# EAGLE design Adafruit Servo HAT rev A (EAGLE 6.3)

## Sheet 1 of 2
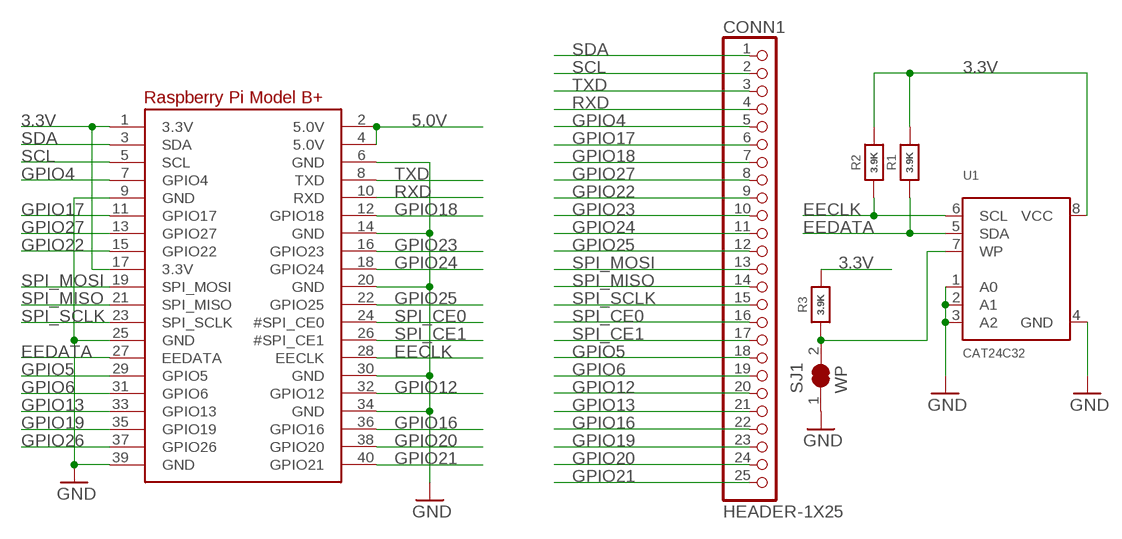
[diagram p0: schematic, sheet 1]

### Parts
CONN1  HEADER-1X25  [1X25_ROUND_70MIL]
R1  3.9K  RESISTOR0805_NOOUTLINE  [0805-NO]
R2  3.9K  RESISTOR0805_NOOUTLINE  [0805-NO]
R3  3.9K  RESISTOR0805_NOOUTLINE  [0805-NO]
RPI1  RASPBERRYPI_BPLUS_HATSLOTS  [PI_HAT_SLOTS]
SJ1  WP  SOLDERJUMPER_CLOSED  [SOLDERJUMPER_CLOSEDWIRE]
U1  CAT24C32  EEPROM_I2C_SOIC8_GENERIC  [SOIC8_150MIL]

### Nets
3.3V: R1.2 R2.2 R3.2 RPI1.1(3.3V) RPI1.17(3.3V) U1.8(VCC) ; also sheet 2
5.0V: RPI1.2(5.0V) RPI1.4(5.0V)
EECLK: R2.1 RPI1.28(EECLK) U1.6(SCL)
EEDATA: R1.1 RPI1.27(EEDATA) U1.5(SDA)
GND: RPI1.6(GND) RPI1.9(GND) RPI1.14(GND) RPI1.20(GND) RPI1.25(GND) RPI1.30(GND) RPI1.34(GND) RPI1.39(GND) SJ1.1 U1.1(A0) U1.2(A1) U1.3(A2) U1.4(GND) ; also sheet 2
GPIO4: CONN1.5 RPI1.7(GPIO4)
GPIO5: CONN1.18 RPI1.29(GPIO5)
GPIO6: CONN1.19 RPI1.31(GPIO6)
GPIO12: CONN1.20 RPI1.32(GPIO12)
GPIO13: CONN1.21 RPI1.33(GPIO13)
GPIO16: CONN1.22 RPI1.36(GPIO16)
GPIO17: CONN1.6 RPI1.11(GPIO17)
GPIO18: CONN1.7 RPI1.12(GPIO18)
GPIO19: CONN1.23 RPI1.35(GPIO19)
GPIO20: CONN1.24 RPI1.38(GPIO20)
GPIO21: CONN1.25 RPI1.40(GPIO21)
GPIO22: CONN1.9 RPI1.15(GPIO22)
GPIO23: CONN1.10 RPI1.16(GPIO23)
GPIO24: CONN1.11 RPI1.18(GPIO24)
GPIO25: CONN1.12 RPI1.22(GPIO25)
GPIO26: RPI1.37(GPIO26)
GPIO27: CONN1.8 RPI1.13(GPIO27)
N$16: R3.1 SJ1.2 U1.7(WP)
RXD: CONN1.4 RPI1.10(RXD)
SCL: CONN1.2 RPI1.5(SCL) ; also sheet 2
SDA: CONN1.1 RPI1.3(SDA) ; also sheet 2
SPI_CE0: CONN1.16 RPI1.24(#SPI_CE0)
SPI_CE1: CONN1.17 RPI1.26(#SPI_CE1)
SPI_MISO: CONN1.14 RPI1.21(SPI_MISO)
SPI_MOSI: CONN1.13 RPI1.19(SPI_MOSI)
SPI_SCLK: CONN1.15 RPI1.23(SPI_SCLK)
TXD: CONN1.3 RPI1.8(TXD)

## Sheet 2 of 2
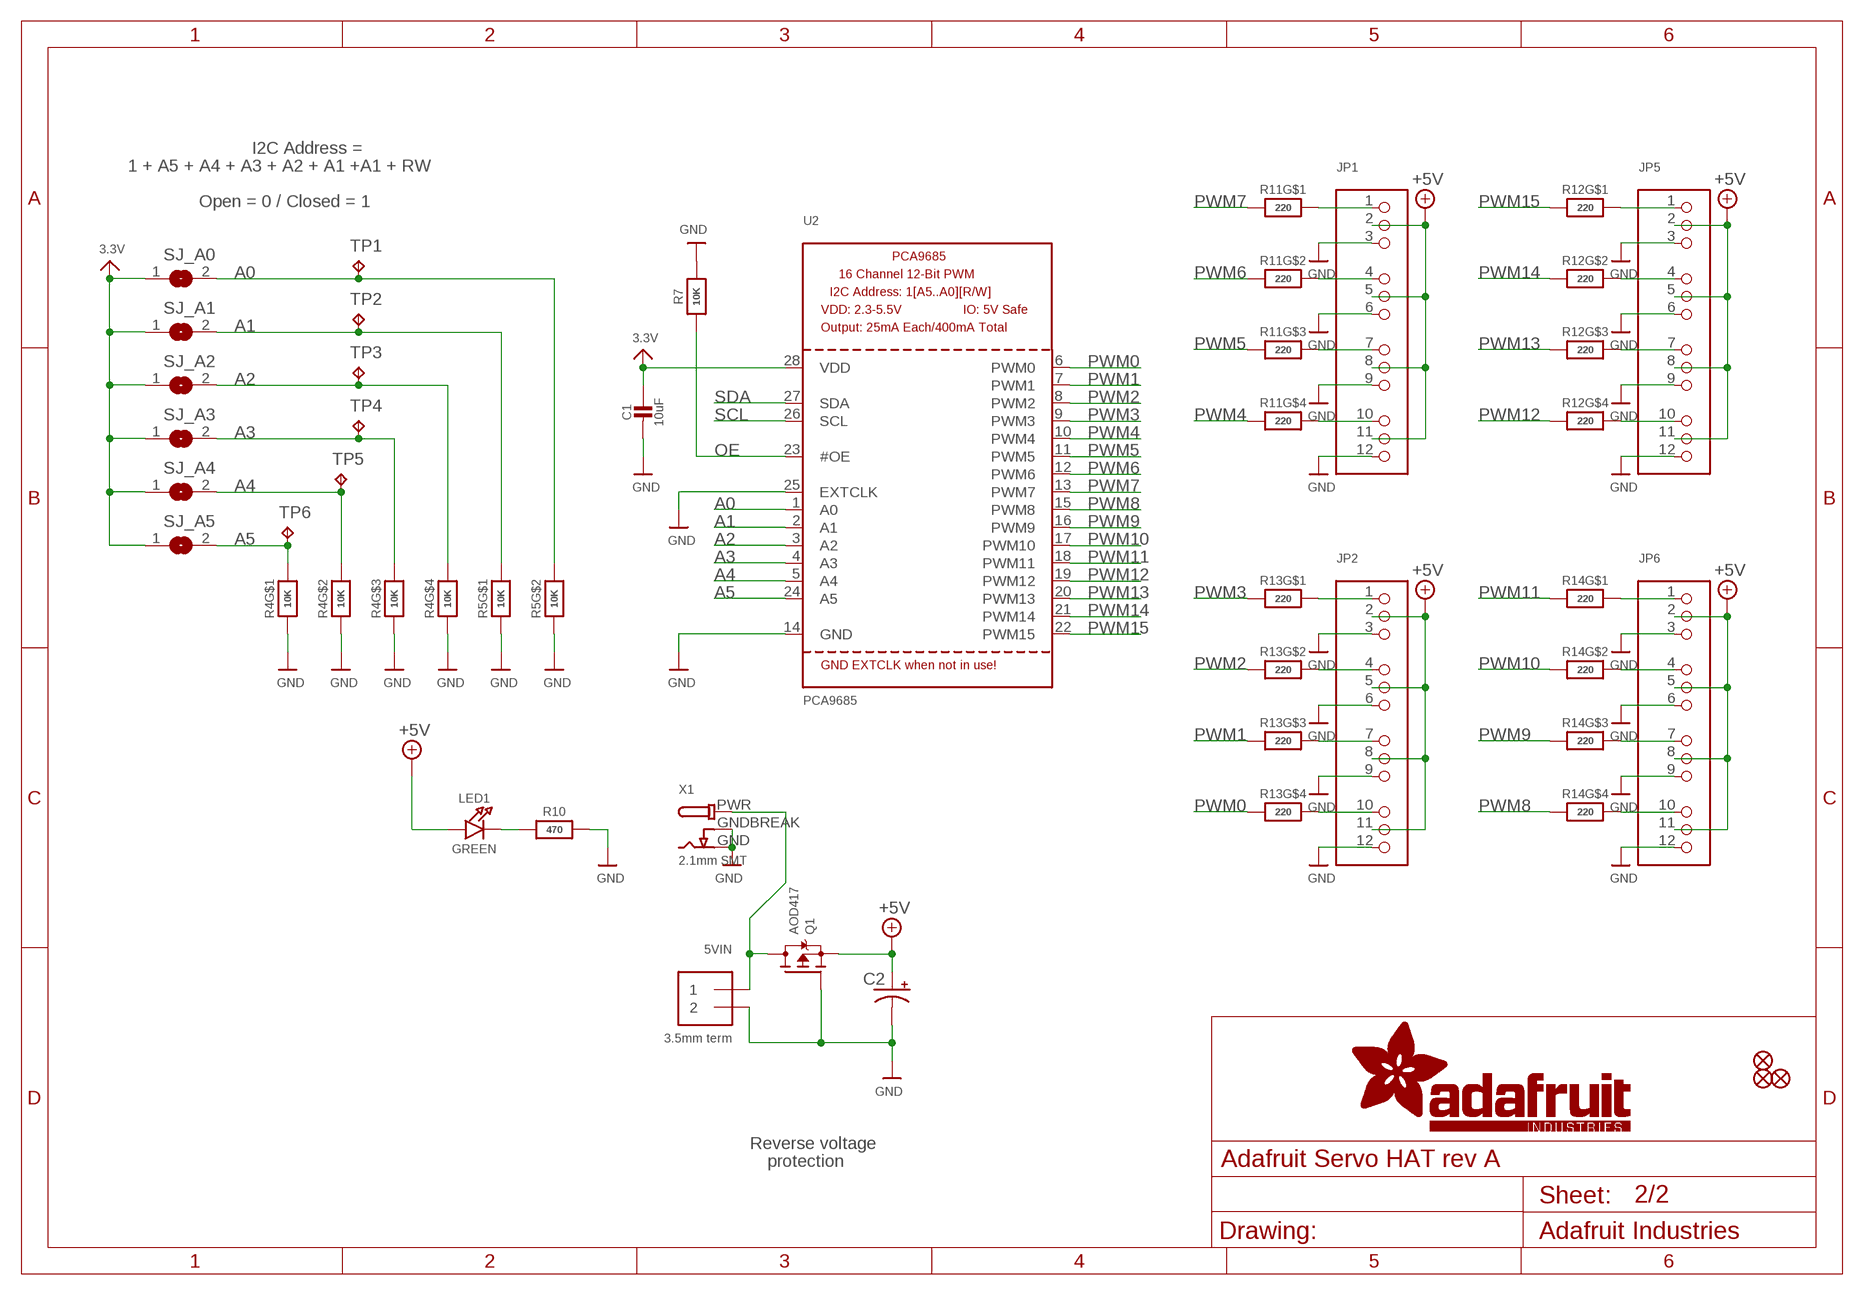
[diagram p1: schematic, sheet 2]

### Parts
5VIN  3.5mm term  TERMBLOCK_1X2  [TERMBLOCK_1X2-3.5MM]
C1  10uF  CAP_CERAMIC0805-NOOUTLINE  [0805-NO]
C2  CPOL-USE3.5-8  [E3,5-8]
FID1  FIDUCIAL""  [FIDUCIAL_1MM]
FID2  FIDUCIAL""  [FIDUCIAL_1MM]
FID3  FIDUCIAL""  [FIDUCIAL_1MM]
JP1  HEADER-3X04  [3X04]
JP2  HEADER-3X04  [3X04]
JP5  HEADER-3X04  [3X04]
JP6  HEADER-3X04  [3X04]
LED1  GREEN  LED0805_NOOUTLINE  [CHIPLED_0805_NOOUTLINE]
Q1  AOD417  MOSFET-PTO252  [TO252]
R4  10K  RESISTOR_4PACK  [RESPACK_4X0603]
R5  10K  RESISTOR_4PACK  [RESPACK_4X0603]
R7  10K  RESISTOR0805_NOOUTLINE  [0805-NO]
R10  470  RESISTOR_0805MP  [_0805MP]
R11  220  RESISTOR_4PACK  [RESPACK_4X0603]
R12  220  RESISTOR_4PACK  [RESPACK_4X0603]
R13  220  RESISTOR_4PACK  [RESPACK_4X0603]
R14  220  RESISTOR_4PACK  [RESPACK_4X0603]
SJ_A0  SOLDERJUMPERREFLOW_NOPASTE  [SOLDERJUMPER_REFLOW_NOPASTE]
SJ_A1  SOLDERJUMPERREFLOW_NOPASTE  [SOLDERJUMPER_REFLOW_NOPASTE]
SJ_A2  SOLDERJUMPERREFLOW_NOPASTE  [SOLDERJUMPER_REFLOW_NOPASTE]
SJ_A3  SOLDERJUMPERREFLOW_NOPASTE  [SOLDERJUMPER_REFLOW_NOPASTE]
SJ_A4  SOLDERJUMPERREFLOW_NOPASTE  [SOLDERJUMPER_REFLOW_NOPASTE]
SJ_A5  SOLDERJUMPERREFLOW_NOPASTE  [SOLDERJUMPER_REFLOW_NOPASTE]
TP1  TPB1,27  [B1,27]
TP2  TPB1,27  [B1,27]
TP3  TPB1,27  [B1,27]
TP4  TPB1,27  [B1,27]
TP5  TPB1,27  [B1,27]
TP6  TPB1,27  [B1,27]
U2  PCA9685  [TSSOP28]
X1  2.1mm SMT  DCBARRELSMT_CORRECT  [DCJACK_2MM_SMT]

### Nets
3.3V: C1.1 SJ_A0.1 SJ_A1.1 SJ_A2.1 SJ_A3.1 SJ_A4.1 SJ_A5.1 U2.28(VDD) ; also sheet 1
+5V: C2.+ JP1.2 JP1.5 JP1.8 JP1.11 JP2.2 JP2.5 JP2.8 JP2.11 JP5.2 JP5.5 JP5.8 JP5.11 JP6.2 JP6.5 JP6.8 JP6.11 LED1.A Q1.2(S)
A0: R5.7 SJ_A0.2 TP1.TP U2.1(A0)
A1: R5.8 SJ_A1.2 TP2.TP U2.2(A1)
A2: R4.5 SJ_A2.2 TP3.TP U2.3(A2)
A3: R4.6 SJ_A3.2 TP4.TP U2.4(A3)
A4: R4.7 SJ_A4.2 TP5.TP U2.5(A4)
A5: R4.8 SJ_A5.2 TP6.TP U2.24(A5)
GND: 5VIN.2 C1.2 C2.- JP1.3 JP1.6 JP1.9 JP1.12 JP2.3 JP2.6 JP2.9 JP2.12 JP5.3 JP5.6 JP5.9 JP5.12 JP6.3 JP6.6 JP6.9 JP6.12 Q1.1(G) R4.1 R4.2 R4.3 R4.4 R5.1 R5.2 R7.2 R10.2 U2.14(GND) U2.25(EXTCLK) X1.GND X1.GNDBREAK ; also sheet 1
N$24: LED1.C R10.1
N$25: JP1.4 R11.7
N$26: JP1.1 R11.8
N$27: JP1.7 R11.6
N$28: JP1.10 R11.5
N$29: JP2.1 R13.8
N$30: JP2.4 R13.7
N$31: JP2.7 R13.6
N$32: JP2.10 R13.5
N$33: JP6.10 R14.5
N$34: JP6.7 R14.6
N$35: JP6.4 R14.7
N$36: JP6.1 R14.8
N$37: JP5.10 R12.5
N$38: JP5.7 R12.6
N$40: JP5.4 R12.7
N$63: JP5.1 R12.8
OE: R7.1 U2.23(#OE)
PWM0: R13.4 U2.6(PWM0)
PWM1: R13.3 U2.7(PWM1)
PWM2: R13.2 U2.8(PWM2)
PWM3: R13.1 U2.9(PWM3)
PWM4: R11.4 U2.10(PWM4)
PWM5: R11.3 U2.11(PWM5)
PWM6: R11.2 U2.12(PWM6)
PWM7: R11.1 U2.13(PWM7)
PWM8: R14.4 U2.15(PWM8)
PWM9: R14.3 U2.16(PWM9)
PWM10: R14.2 U2.17(PWM10)
PWM11: R14.1 U2.18(PWM11)
PWM12: R12.4 U2.19(PWM12)
PWM13: R12.3 U2.20(PWM13)
PWM14: R12.2 U2.21(PWM14)
PWM15: R12.1 U2.22(PWM15)
PWRIN: 5VIN.1 Q1.3(D) X1.PWR
SCL: U2.26(SCL) ; also sheet 1
SDA: U2.27(SDA) ; also sheet 1
Unconnected: R5.3 R5.4 R5.5 R5.6

### Notes on the sheet
- I2C Address =
- 1 + A5 + A4 + A3 + A2 + A1 +A1 + RW
- Open = 0 / Closed = 1
- Reverse voltage
- protection

## Library data of the parts
5VIN = microbuilder:TERMBLOCK_1X2: 3.5mm Terminal block http://www.ladyada.net/library/pcb/eaglelibrary.html
C1 = microbuilder:CAP_CERAMIC: Ceramic Capacitors For new designs, use the packages preceded by an '_' character since they are more reliable: The following footprints should be used on most boards: _0402 - Standard footprint for regular board layouts _0603 - Standard footprint for regular board layouts _0805 - Standard footprint for regular board layouts _1206 - Standard footprint for regular board layouts For extremely tight-pitch boards where space is at a premium, the following 'micro-pitch' footprints can be used (smaller pads, no silkscreen outline, etc.): _0402MP - Micro-pitch footprint for very dense/compact boards _0603MP - Micro-pitch footprint for very dense/compact boards _0805MP - Micro-pitch footprint for very dense/compact boards _1206MP - Micro-pitch footprint for very dense/compact boards
C2 = adafruit:CPOL-US: POLARIZED CAPACITOR, American symbol
CONN1 = microbuilder:HEADER-1X25
FID1-FID3 = microbuilder:FIDUCIAL: Fiducial Alignment Points Various fiducial points for machine vision alignment.; BOM: EXCLUDE
JP1 JP2 JP5 JP6 = microbuilder:HEADER-3X04
LED1 = microbuilder:LED: LED 0603 - 0603 Surface Mount Package 2mA: Green LED - Low Power (3.9mcd, 2ma, 1.7Vf) - Digikey: 475-2709-2-ND Orange LED - Low Power (9.8mcd, 2ma, 1.8Vf) - Digikey: 475-1194-2-ND Red LED - Low Power (5mcd, 2ma, 1.8Vf) - Digikey: 475-1195-2-ND Yellow LED - Low Power (7mcd, 2ma, 1.8Vf) - Digikey: 475-1196-2-ND 5mA: Blue LED - Low Power (17mcd, 5ma, 2.9Vf) - Digikey: LNJ937W8CRACT-ND 0805 - 0805 Surface Mount Package 2mA: Red LED (8.8mcd, 2mA, 1.8Vf, Clear) - Low Power [Digikey: 475-2510-1-ND] Green LED (5mcd, 2mA, 1.8Vf, Clear) - Low Power [Digikey: 475-2730-1-ND] Yellow LED (11.3mcd, 2mA, 1.8Vf, Clear) - Low Power [Digikey: 475-2555-1-ND] 20mA: Red LED (104mcd, 20mA, Diffused) - LS R976 [Digikey: 475-1278-6-ND] Red LED (12mcd, 20mA, 2.0Vf, Clear) - APT2012EC [Digikey: 754-1128-1-ND] Green LED (15mcd, 20mA, 2.2Vf, Clear) - APT2012GC [Digikey: 754-1131-1-ND] Orange LED (160mcd, 20mA, 2.1Vf, Clear) - APT2012SECK [Digikey: 754-1130-1-ND] 1206 - 1206 Surface Mount Package Green LED (26mcd, 20mA, Diffused) - LG N971 [Digikey: 475-1407-6-ND] Red LED (15mcd, 20mA, Diffused) - LH N974 [Digikey: 475-1416-6-ND] Cree - Cree High-Power Surface Mount LEDs XPEBWT-L1-0000-00D50 - White 111lm 350mA 2.9Vf 6200K 110° XTEAWT-00-0000-00000LEE3 - White 114lm 350mA 2.85Vf 5000K 115° Everlight - Everlight 45-21 Series Surface Mount LEDs 45-21/QK2C-B2832AC2CB2/2T - Warm White 2000mcd 20mA 3.25Vf 3050K 120° 45-21/LK2C-B38452C4CB2/2T - Nuetral White 2000mcd 20mA 3.25Vf 4150K 120° 45-21/LK2C-B50634C6CB2/2T - Cold White 2200mcd 20mA 3.25Vf 5650K 120° PLCC2 Reverse Mount LS T77K-J1L2-1-0-2-R18-Z - Red 11.25mcd 2mA 1.8Vf 630nm 120° LO T77K-L1M2-24-Z - Orange 19.6mcd 2mA 1.8Vf 606nm 120° LY T77K-K2M1-26-Z - Yellow 15.7mcd 2mA 1.8Vf 587nm 120°
Q1 = microbuilder:MOSFET-P: P-Channel Mosfet LEGEND VDS: Voltage Drain-Source ID: Drain Current RDS(ON): Drain-Source On-State Resistance VGS(TH): Gate-Source Threshold Voltage CISS: Drain-Source Input Capacitance SOT-23 Name VDS ID RDS(ON) VGS(TH) CISS Order Number IRLML5103 30V 760mA 600 mOhm -- 75pF @ 25V Digikey: IRLML5103PBFCT-ND IRLML6401 12V 4.3A 50 mOhm 950mV @ 250µA 830pF @ 10V Digikey: IRLML6401PBFTR-ND NTR0202PL 20V 400mA 800 mOhm 2.3V @ 250uA 70pF @ 5V Digikey: NTR0202PLT1GOSTR-ND NTR4101PT1G 20V 1.8A 85 mOhm 1.2V @ 250uA 675pF @ 10V Digikey: NTR4101PT1GOSCT-ND DMP2004K 20V 600mA 900 mOhm 1V @ 250uA 175pF @ 16V Digikey: DMP2004KDICT-ND PMV65XP 20V 3.9A 76 mOhm 950mV @ 1mA 725pF @ 20V Digikey: 568-2358-2-ND TO-252 Name VDS ID RDS(ON) VGS(TH) CISS Order Number AOD417 30V 25A 34 mOhm 3V @ 250µA 920pF @ 15V Digikey: 785-1106-2-ND
R1-R3 R7 R10 = microbuilder:RESISTOR: Resistors For new designs, use the packages preceded by an '_' character since they are more reliable: The following footprints should be used on most boards: _0402 - Standard footprint for regular board layouts _0603 - Standard footprint for regular board layouts _0805 - Standard footprint for regular board layouts _1206 - Standard footprint for regular board layouts For extremely tight-pitch boards where space is at a premium, the following 'micro-pitch' footprints can be used (smaller pads, no silkscreen outline, etc.): _0402MP - Micro-pitch footprint for very dense/compact boards _0603MP - Micro-pitch footprint for very dense/compact boards _0805MP - Micro-pitch footprint for very dense/compact boards _1206MP - Micro-pitch footprint for very dense/compact boards
R4 R5 R11-R14 = microbuilder:RESISTOR_4PACK: Resistor Packs (4 resistors) 4 x 0603 10K 1/16W - Digikey: YC164J-10KCT-ND
RPI1 = microbuilder:RASPBERRYPI_BPLUS
SJ1 = microbuilder:SOLDERJUMPER_CLOSED: Solder Jumper - Closed These solder jumpers are closed by default CLOSEDWIRE - 10 mil trace between pads that can be cut and resoldered later CLOSEDPERM - 63 mil trace between pads for a permanent connection (used to 'bridge' two signals, a shameless hack for Eagle). Can double as a test point as well (no cream layer)
SJ_A0 SJ_A1-SJ_A5 = microbuilder:SOLDERJUMPER: SMD Solder JUMPER Solder the two pads together to create a connection, or remove the solder to break it. REFLOW - Use this footprint for solder paste and reflow ovens. WAVE - Use this footprint for hand-soldering (larger pads). CLOSED - Has a trace between the two pads to ensure it is closed by default. The trace needs to be cut to disable the jumper, and can be closed again by creating a solder bridge between the two pads.
TP1-TP6 = testpad:TP: Test pad
U1 = microbuilder:EEPROM_I2C_SOIC8_GENERIC: Note: The same pinout is used for many I2C EEPROMs in SOIC8(150mil) from a variety of manufacturers and in various sizes. Examples: 16K (2K x 8 Bit) I2C EEPROM 1.7-5.5V, 400KHz, -40°C-85°C Digikey: CAT24C16WI-GT3CT-ND 256K (32K x 8 Bit) I2C EEPROM 1.7-5.5V, 400KHz, -40°C-85°C Digikey: 24AA256-I/SN-ND
U2 = microbuilder:PCA9685: PCA9685 - 16 Channel 12-Bit I2C PWM Controller 5.0V tolerant 16 channel, 12-bit I2C PWM controller with 25mA per output (max. 400mA total) Digikey: 568-5931-1-ND
X1 = microbuilder:DCBARREL: DC Barrel Jack DCJACK_1.3MM_PTH - Through Hole 1.3mm Jack (4UConnector: 05536) DCJACK_2MM_PTH - Through Hole 2.0/2.1 Jack (4UConnector: 05537) DCJACK_2MM_SMT - SMT 2.0/2.1mm Jack(4UConnector: 03267)

## Board
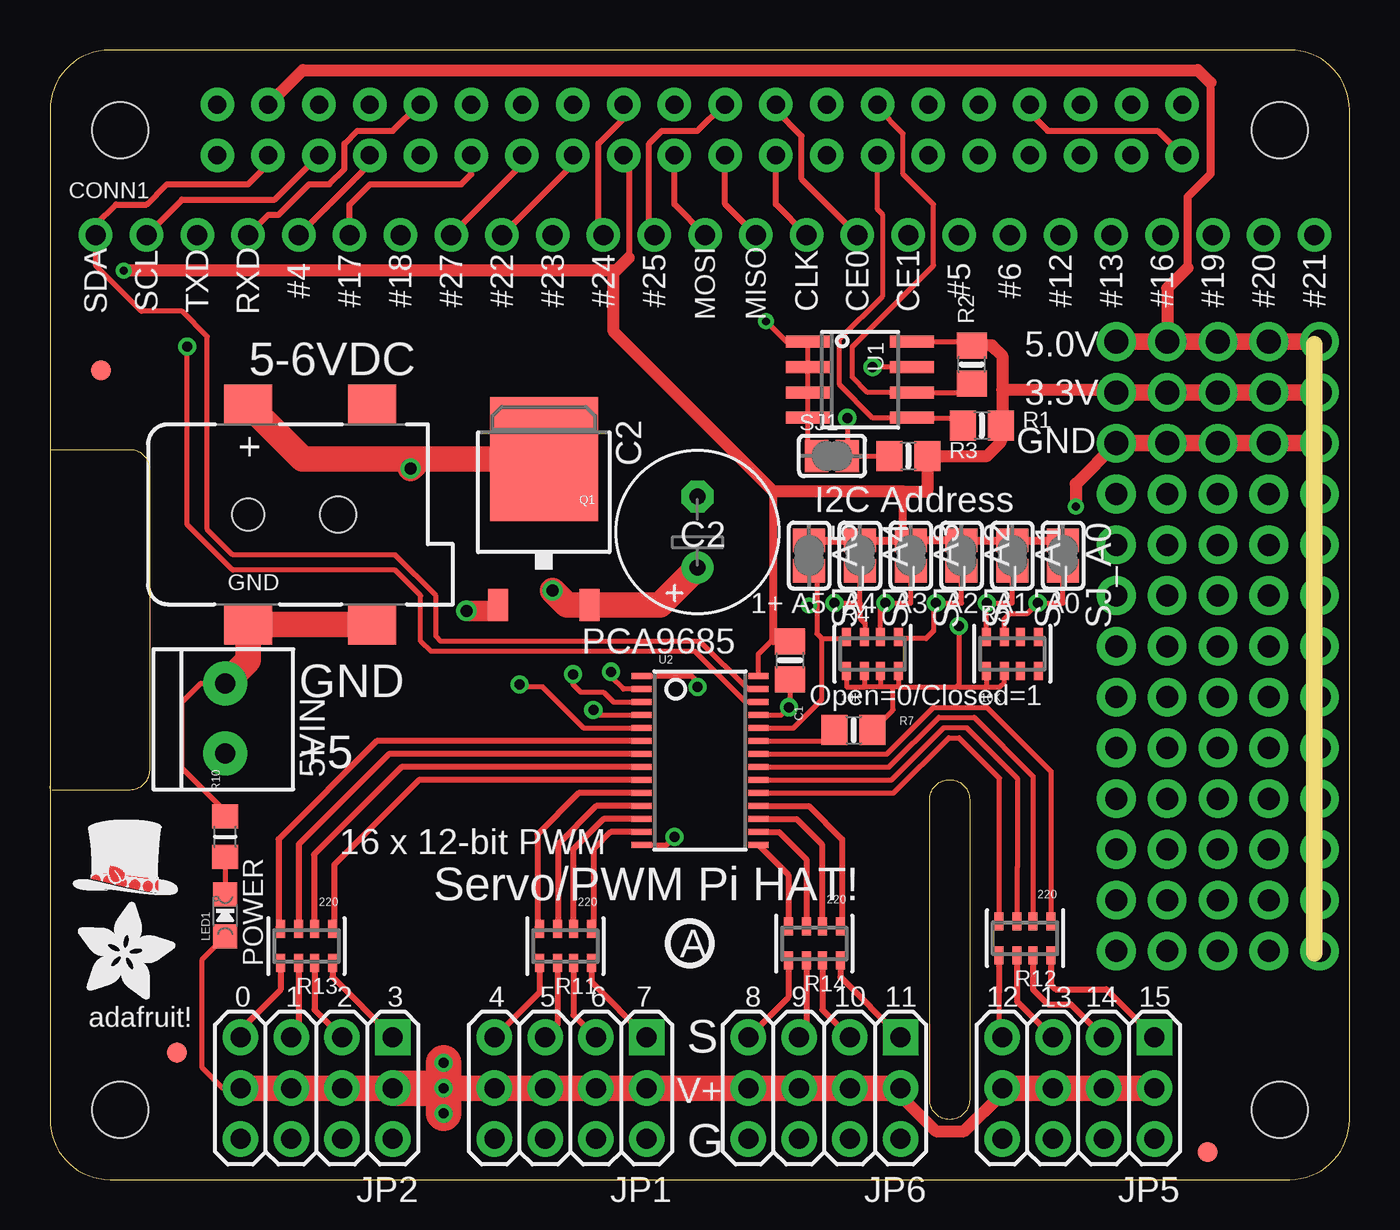
[diagram p2: board, top side]
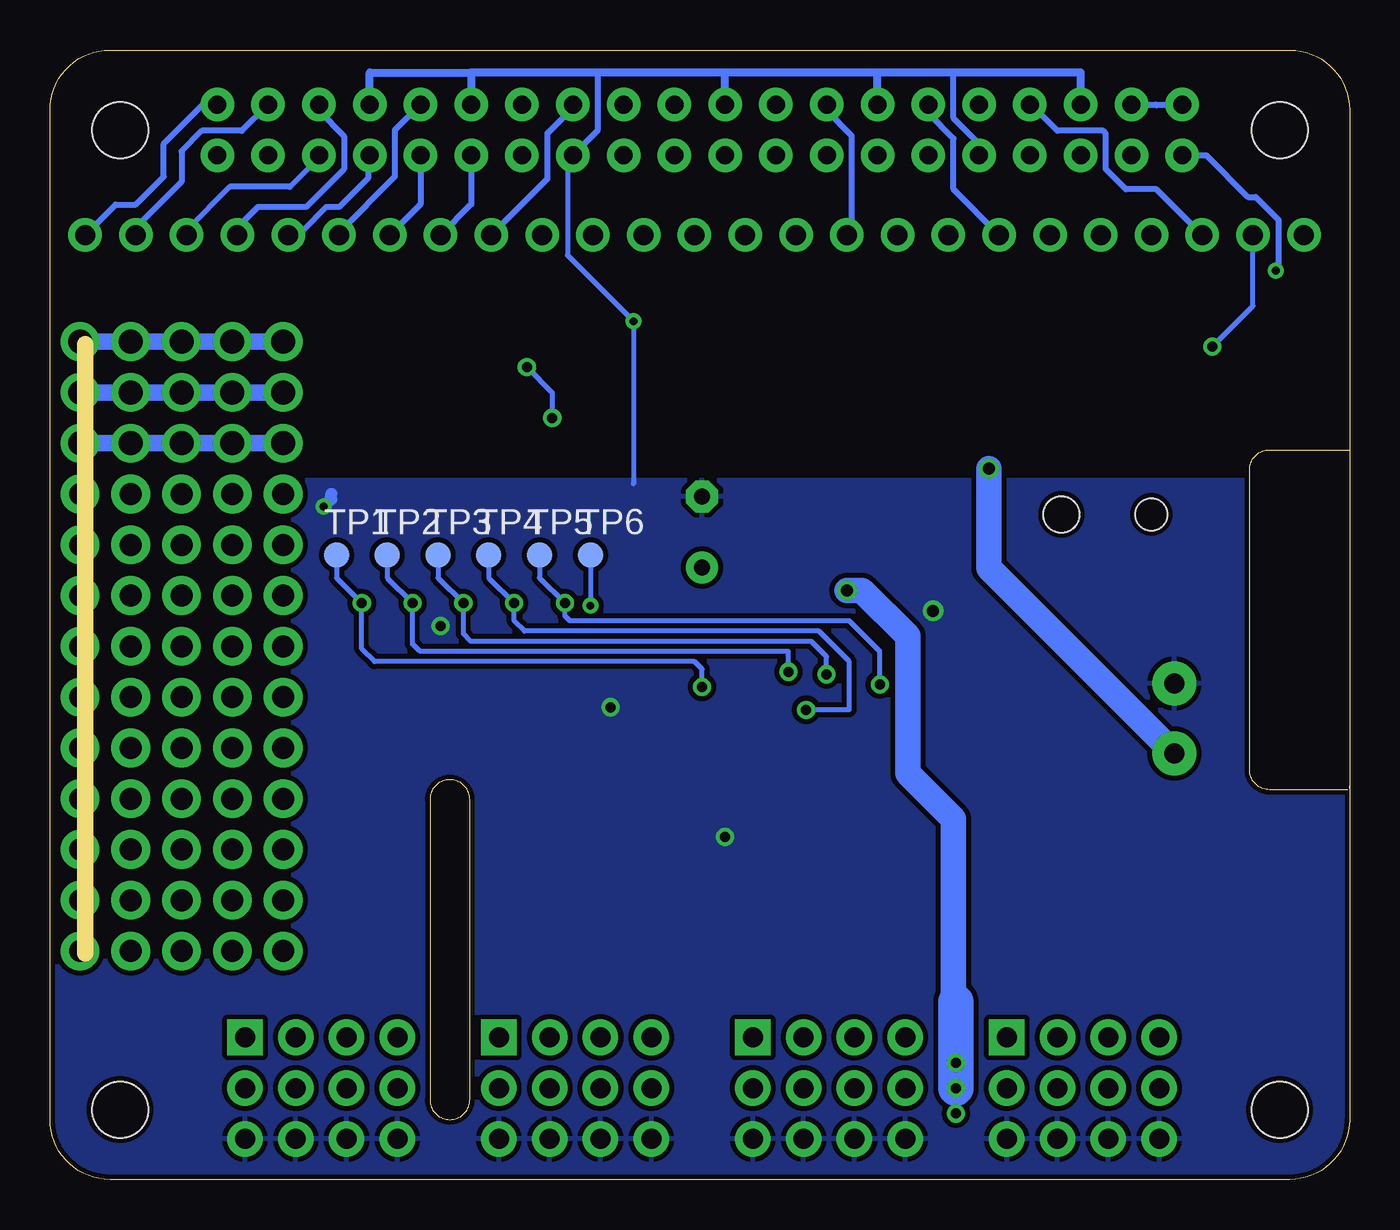
[diagram p3: board, bottom side, seen from below]

Size 65 x 56.5 mm. Coordinates in mm from the lower left corner, seen from the top.
Outline: 0,19.56 0,19.68
Copper layers (1*16): Top 0.035mm / dielectric 1.5mm / Bottom 0.035mm
Design rules "adafruit *": minimum track width 8mil, minimum drill 15.5mil, track to track 8mil, track to pad 8mil, pad to pad 8mil, via to via 8mil, smd to smd 8mil, copper to edge 10mil, drill to drill 8mil, minimum pad ring 10mil, minimum via ring 8mil, stop-mask expansion 2mil, vias tented up to drill 20mil, thermal gap 10mil
Milling: 1 lines

### Footprints (pad centres in the part's own frame; a part is rotated, then mirrored left to right if it is on the bottom)
TERMBLOCK_1X2-3.5MM = drill 1 pad 2.184: 1 1.8,0; 2 -1.7,0
0805-NO = smd 1.3 x 1.5: 1 -0.95,0; 2 0.95,0
E3,5-8 = drill 0.813 pad 1.6: + -1.778,0 | drill 0.813 pad 1.6 octagon: - 1.778,0
1X25_ROUND_70MIL = drill 1 pad 1.676: 1 -30.48,0; 2 -27.94,0; 3 -25.4,0; 4 -22.86,0; 5 -20.32,0; 6 -17.78,0; 7 -15.24,0; 8 -12.7,0; 9 -10.16,0; 10 -7.62,0; 11 -5.08,0; 12 -2.54,0; 13 0,0; 14 2.54,0; 15 5.08,0; 16 7.62,0; 17 10.16,0; 18 12.7,0; 19 15.24,0; 20 17.78,0; 21 20.32,0; 22 22.86,0; 23 25.4,0; 24 27.94,0; 25 30.48,0
FIDUCIAL_1MM = smd 1 x 1: 1 0,0
3X04 = drill 1 pad 1.778 square: 1 -3.81,-2.54 | drill 1 pad 1.778: 2 -3.81,0; 3 -3.81,2.54; 4 -1.27,-2.54; 5 -1.27,0; 6 -1.27,2.54; 7 1.27,-2.54; 8 1.27,0; 9 1.27,2.54; 10 3.81,-2.54; 11 3.81,0; 12 3.81,2.54
CHIPLED_0805_NOOUTLINE = smd 1.2 x 1.2: A 0,-1.05; C 0,1.05
TO252 = smd 1 x 1.6: 1 -2.28,-4.8; 2 2.28,-4.8 | smd 5.4 x 6.2: 3 0,2.5
RESPACK_4X0603 = smd 0.45 x 0.9: 1 -1.3,-0.85; 2 -0.4,-0.85; 3 0.4,-0.85; 4 1.3,-0.85; 5 1.3,0.85; 6 0.4,0.85; 7 -0.4,0.85; 8 -1.3,0.85
_0805MP = smd 1.2 x 1.3: 1 -1.016,0; 2 1.016,0
PI_HAT_SLOTS = drill 0.9 pad 1.676: 1 8.37,51.23; 2 8.37,53.77; 3 10.91,51.23; 4 10.91,53.77; 5 13.45,51.23; 6 13.45,53.77; 7 15.99,51.23; 8 15.99,53.77; 9 18.53,51.23; 10 18.53,53.77; 11 21.07,51.23; 12 21.07,53.77; 13 23.61,51.23; 14 23.61,53.77; 15 26.15,51.23; 16 26.15,53.77; 17 28.69,51.23; 18 28.69,53.77; 19 31.23,51.23; 20 31.23,53.77; 21 33.77,51.23; 22 33.77,53.77; 23 36.31,51.23; 24 36.31,53.77; 25 38.85,51.23; 26 38.85,53.77; 27 41.39,51.23; 28 41.39,53.77; 29 43.93,51.23; 30 43.93,53.77; 31 46.47,51.23; 32 46.47,53.77; 33 49.01,51.23; 34 49.01,53.77; 35 51.55,51.23; 36 51.55,53.77; 37 54.09,51.23; 38 54.09,53.77; 39 56.63,51.23; 40 56.63,53.77 | hole 2.8: 3.5,3.5; 3.5,52.5; 61.5,52.5; 61.5,3.5
SOLDERJUMPER_CLOSEDWIRE = smd 1.168 x 1.6: 1 -0.762,0; 2 0.762,0 | smd 0.635 x 0.203: WIRE 0,0
SOLDERJUMPER_REFLOW_NOPASTE = smd 1.168 x 1.6: 1 -0.762,0; 2 0.762,0
B1,27 = smd 1.27 x 1.27: TP 0,0
SOIC8_150MIL = smd 0.6 x 2.2: 1 -1.905,-2.6; 2 -0.635,-2.6; 3 0.635,-2.6; 4 1.905,-2.6; 5 1.905,2.6; 6 0.635,2.6; 7 -0.635,2.6; 8 -1.905,2.6
TSSOP28 = smd 0.305 x 0.991: 1 -4.225,-2.918; 2 -3.575,-2.918; 3 -2.925,-2.918; 4 -2.275,-2.918; 5 -1.625,-2.918; 6 -0.975,-2.918; 7 -0.325,-2.918; 8 0.325,-2.918; 9 0.975,-2.918; 10 1.625,-2.918; 11 2.275,-2.918; 12 2.925,-2.918; 13 3.575,-2.918; 14 4.225,-2.918; 15 4.225,2.918; 16 3.575,2.918; 17 2.925,2.918; 18 2.275,2.918; 19 1.625,2.918; 20 0.975,2.918; 21 0.325,2.918; 22 -0.325,2.918; 23 -0.975,2.918; 24 -1.625,2.918; 25 -2.275,2.918; 26 -2.925,2.918; 27 -3.575,2.918; 28 -4.225,2.918
DCJACK_2MM_SMT = smd 2.4 x 2: GND 0,-5.5; GNDBREAK 6.2,-5.5; PWR 0,5.5; PWR2 6.2,5.5 | hole 1.6: 0,0 | hole 1.8: 4.5,0

### Placement (x,y rotation side)
5VIN  8.76,23.11 270 top
C1  37,25.97 270 top
C2  32.38,32.38 90 top
CONN1  32.77,47.24 0 top
FID1  57.9,1.36 0 top
FID2  2.54,40.49 0 top
FID3  6.35,6.35 0 top
JP1  26.04,4.57 180 top
JP2  13.34,4.57 180 top
JP5  51.44,4.57 180 top
JP6  38.73,4.57 180 top
LED1  8.76,13.21 0 top
Q1  24.7,33.54 0 top
R1  46.61,37.72 0 top
R2  46.1,40.77 90 top
R3  42.93,36.2 0 top
R4  41.15,26.29 0 top
R5  48.13,26.29 0 top
R7  40.2,22.48 0 top
R10  8.76,17.14 90 top
R11  25.78,11.68 180 top
R12  48.77,12.06 180 top
R13  12.83,11.68 180 top
R14  38.23,11.81 180 top
RPI1  0,0 0 top
SJ1  39.12,36.2 0 top
SJ_A0  50.67,31.21 270 top
SJ_A1  48.13,31.21 270 top
SJ_A2  45.59,31.21 270 top
SJ_A3  43.05,31.21 270 top
SJ_A4  40.51,31.21 270 top
SJ_A5  37.97,31.21 270 top
TP1  50.67,31.24 0 bottom
TP2  48.13,31.24 0 bottom
TP3  45.59,31.24 0 bottom
TP4  43.05,31.24 0 bottom
TP5  40.51,31.24 0 bottom
TP6  37.97,31.24 0 bottom
U1  40.51,40.01 270 top
U2  32.51,20.95 270 top
U$5  [PIHATLOGO]  1.14,14.22 0 top
U$6  [PCBFEAT-REV-056]  32,11.81 0 top
U$51  [ADAFRUIT_5MM]  1.4,9.02 0 top
X1  9.91,33.27 0 top

### Tracks (layer width: path | path; a pad name or v marks a point on that pad's centre or on a via)
3.3V  (via drill 0.39, 1.2 pad 1.93)
  Top 0.254: U1.8 45.91,41.91 R2.2 | SJ_A4.1 40.13,32.35 | 37.13,26.8 C1.1 36.07,26.92 35.43,26.29 U2.28
  Top 0.305: RPI1.17 28.96,50.96 28.96,46.1 | 28.32,45.47 28.19,45.47
  Top 0.406: 42.67,31.97 SJ_A4.1 SJ_A5.1 37.94,32 | 42.67,31.97 SJ_A3.1 SJ_A2.1 SJ_A1.1 SJ_A0.1 | 42.67,31.97 42.67,34.42 | C1.1 36.2,26.92 36.2,34.42
  Top 0.61: 28.96,46.1 28.32,45.47 | v3.68,45.47 28.19,45.47 28.19,42.42 36.2,34.42 42.67,34.42 43.88,34.42 43.88,34.48 43.88,34.67 R3.2 46.86,36.2 47.56,36.89 R1.2 47.56,38.16 47.62,38.23 47.62,39.5 | R2.2 46.45,42.07 46.8,41.72 47.12,41.72 47.62,41.21 47.62,39.5 | v53.34,39.37 53.21,39.5 47.62,39.5
  Top 0.813: v53.34,39.37 v63.5,39.37
  Bottom 0.305: RPI1.1 7.16,51.23 5.08,49.15 4.7,49.15 3.56,48.01 3.56,45.47 | 3.56,45.47 3.56,45.34 | v3.68,45.47 3.56,45.47
  Bottom 0.813: v53.34,39.37 v55.88,39.37 v58.42,39.37 v60.96,39.37 v63.5,39.37
5.0V  (via drill 1.2 pad 1.93)
  Top 0.406: 58.04,54.86 58.04,50.29 56.9,49.15 56.9,45.59
  Top 0.61: RPI1.4 12.64,55.5 57.4,55.5 58.04,54.86 | 56.9,45.59 55.88,44.58 v55.88,41.91
  Top 0.813: v53.34,41.91 v55.88,41.91 v63.5,41.91
  Bottom 0.305: RPI1.4 9.7,53.77 | 9.7,53.77 RPI1.2 | 9.7,53.77 9.65,53.72
  Bottom 0.813: v63.5,41.91 v60.96,41.91 v58.42,41.91 v55.88,41.91 v53.34,41.91
+5V  (via drill 0.5, 0.6)
  Top 0.254: 9.4,4.57 JP2.11 8.64,4.57 7.62,5.59 7.62,11.02 LED1.A
  Top 0.61: JP6.2 42.55,4.19 44.32,2.41 45.72,2.41 47.62,4.32 JP5.11
  Top 1.27: JP2.11 JP2.8 JP2.5 JP2.2 | v19.68,4.57 JP1.11 JP1.8 JP1.5 JP1.2 JP6.11 JP6.8 JP6.5 JP6.2 | JP5.11 JP5.8 JP5.5 JP5.2 | C2.+ 30.52,28.74 Q1.2 25.87,28.74 v25.15,29.46
  Top 1.778: v19.68,4.57 JP2.2 | v19.68,4.57 v19.68,5.84 | v19.68,4.57 v19.68,3.3
  Bottom 1.27: 19.68,8.89 19.81,9.02 19.81,18.03 22.1,20.32 22.1,27.18 24.38,29.46 v25.15,29.46
  Bottom 1.778: v19.68,4.57 19.68,8.89
A0  (via drill 0.5)
  Top 0.254: SJ_A0.2 50.67,28.83 v49.4,28.83 48.9,28.32 48.01,28.32 47.73,28.05 R5.7 | v32.38,24.64 32.38,24.89 32.1,25.18 U2.1
  Bottom 0.254: v32.38,24.64 32.38,25.53 32.77,25.91 48.77,25.91 49.4,26.54 v49.4,28.83 50.67,30.1 TP1.TP
A1  (via drill 0.5)
  Top 0.254: SJ_A1.2 48.13,28.83 v46.86,28.83 46.83,28.8 R5.8 | U2.2 28.68,24.53 28.07,25.15 v28.07,25.4
  Bottom 0.254: v28.07,25.4 28.07,26.42 46.48,26.42 46.86,26.8 v46.86,28.83 48.13,30.1 TP2.TP
A2  (via drill 0.5)
  Top 0.254: SJ_A2.2 45.59,28.83 v44.32,28.83 44.2,28.7 44.2,27.43 43.81,27.05 42.54,27.05 R4.5 | U2.3 28.19,23.88 27.69,24.38 26.54,24.38 26.16,24.77 v26.16,25.27
  Bottom 0.254: v26.16,25.27 26.16,26.16 26.92,26.92 43.94,26.92 44.32,27.3 v44.32,28.83 45.59,30.1 TP3.TP
A3  (via drill 0.5)
  Top 0.254: SJ_A3.2 43.05,28.83 v41.78,28.83 41.55,28.59 R4.6 | U2.4 27.44,23.23 v27.18,23.5
  Bottom 0.254: v27.18,23.5 25.02,23.5 25.02,25.91 26.54,27.43 41.27,27.43 41.78,27.94 v41.78,28.83 43.05,30.1 TP4.TP
A4  (via drill 0.5)
  Top 0.254: 40.51,28.83 SJ_A4.2 | v39.24,28.83 40.51,28.83 | v23.5,24.77 23.62,24.64 24.64,24.64 26.7,22.58 U2.5 | 40.51,28.83 40.51,28.07 40.77,27.81 40.77,27.16 R4.7
  Bottom 0.254: v23.5,24.77 23.5,26.42 25.02,27.94 38.99,27.94 39.24,28.19 v39.24,28.83 40.51,30.1 TP5.TP
A5  (via drill 0.39)
  Top 0.254: U2.24 37.19,22.58 38.61,24 38.61,27.05 | SJ_A5.2 38.35,30.07 38.35,28.57 | 38.35,28.57 38.35,27.3 38.61,27.05 | 38.61,27.05 39.76,27.05 R4.8 | v37.97,28.7 38.23,28.7 38.35,28.57
  Bottom 0.254: TP6.TP v37.97,28.7
EECLK
  Top 0.254: R2.1 45.65,39.37 U1.6 40.89,39.37 40.13,40.13 40.13,41.66 44.2,45.72 44.2,48.77 42.67,50.29 42.67,52.32 41.39,53.61 RPI1.28
EEDATA
  Top 0.254: RPI1.27 41.39,48.53 41.66,48.26 41.66,44.2 39.5,42.04 39.5,39.75 41.15,38.1 U1.5 45.28,38.1 R1.1
GND  (via drill 0.39, 0.5, 0.6, 1.2 pad 1.93)
  Top 0.254: U2.14 30.83,16.73 v31.24,17.14 | U2.25 36.56,23.23 v36.96,23.62 arc90 37.01,23.67 C1.2 | 46.86,24.64 45.47,24.64 45.47,24.77 | 46.86,24.64 47.5,24.64 47.73,24.87 R5.2 | v45.47,27.69 45.47,24.77 | R5.1 46.83,24.67 46.86,24.64 | R4.2 40.75,24.66 40.77,24.64 | R4.3 41.55,24.64 | R4.4 42.45,24.64 | SJ1.1 37.91,36.64 U1.4 U1.3 U1.2 U1.1 36.83,41.91 v35.81,42.93 | R10.2 8.76,18.41 6.6,20.57 6.6,23.88 7.54,24.81 5VIN.2 | R4.1 39.85,24.64 40.77,24.64 | 42.45,24.64 42.16,24.64 | 42.16,24.64 41.55,24.64 | 41.55,24.64 40.77,24.64 | R7.2 42.16,23.5 42.16,24.64 | 42.45,24.64 45.34,24.64 45.47,24.77
  Top 0.305: RPI1.34 49.01,53.35 49.91,52.45 55.41,52.45 RPI1.39
  Top 0.61: v53.34,36.83 51.31,34.8 v51.31,33.66
  Top 0.813: v53.34,36.83 v63.5,36.83
  Top 1.016: Q1.1 22.13,28.45 v20.83,28.45
  Top 1.27: 5VIN.2 9.91,25.96 X1.GND X1.GNDBREAK
  Bottom 0.254: v36.96,23.62 37.21,23.62 | RPI1.25 39.12,50.96 39.12,46.23 v35.81,42.93 35.81,34.8
  Bottom 0.305: 19.94,55.37 19.81,55.24 19.81,53.09 18.53,51.8 RPI1.9 18.53,51.04 | RPI1.25 37.59,52.49 37.59,55.37
  Bottom 0.406: RPI1.34 49.01,55.37 43.94,55.37 | 43.94,55.37 43.94,53.77 RPI1.30 | RPI1.20 31.23,55.37 | 31.23,55.37 37.59,55.37 43.94,55.37 | RPI1.14 23.61,55.37 | 23.61,55.37 31.23,55.37 | RPI1.6 13.45,55.37 19.94,55.37 23.61,55.37
  Bottom 0.61: v51.31,33.66 50.93,34.04 50.93,34.29
  Bottom 0.813: v53.34,36.83 v55.88,36.83 v58.42,36.83 v60.96,36.83 v63.5,36.83
  pour Bottom (isolate 0.254): -0.25,0.13 0,34.95 65.32,34.95 65.06,0.13
GPIO4
  Top 0.305: CONN1.5 15.99,50.79 RPI1.7
GPIO5
  Bottom 0.305: RPI1.29 43.93,48.78 CONN1.18
GPIO6
  Bottom 0.305: RPI1.31 46.47,48.78 CONN1.19
GPIO12
  Bottom 0.305: RPI1.32 47.75,52.49 47.75,50.16 50.55,47.37 CONN1.20
GPIO13
  Bottom 0.305: RPI1.33 49.1,51.23 49.1,50.09 50.55,48.64 51.18,48.64 52.32,47.5 52.83,47.5 CONN1.21
GPIO16
  Bottom 0.305: RPI1.36 51.55,53.45 50.29,52.2 50.29,50.55 52.2,48.64 54.61,48.64 55.63,47.62 CONN1.22
GPIO17
  Top 0.305: CONN1.6 14.99,48.77 16,49.78 20.57,49.78 21.07,50.28 RPI1.11
GPIO18
  Bottom 0.305: CONN1.7 19.81,49.53 19.81,52.07 21.07,53.33 RPI1.12
GPIO19
  Bottom 0.254: 53,49.66 51.55,51.1 RPI1.35 | 56.01,49.66 58.17,47.5 CONN1.23
  Bottom 0.305: 53,49.66 56.01,49.66
GPIO20
  Bottom 0.305: RPI1.38 55.41,52.45 57.4,52.45 58.42,51.44 58.42,49.91 60.71,47.62 CONN1.24
GPIO21
  Bottom 0.305: CONN1.25 61.72,48.77 60.71,48.77 59.31,50.16 59.31,51.82 57.4,53.72 56.68,53.72 RPI1.40
GPIO22
  Top 0.305: CONN1.9 26.15,50.79 RPI1.15
GPIO23
  Bottom 0.305: CONN1.10 24.89,47.5 24.89,52.2 26.15,53.45 RPI1.16
GPIO24
  Top 0.305: CONN1.11 27.43,47.5 27.43,51.82 28.69,53.07 RPI1.18
GPIO25
  Top 0.305: CONN1.12 29.97,47.5 29.97,51.82 30.61,52.45 32.38,52.45 33.7,53.77 RPI1.22
GPIO27
  Top 0.305: CONN1.8 23.61,50.79 RPI1.13
N$1  (via drill 1.1 pad 1.93)
  other vias: 53.34,34.29
N$2  (via drill 1.1 pad 1.93)
  other vias: 55.88,34.29
N$3  (via drill 1.1 pad 1.93)
  other vias: 58.42,34.29
N$4  (via drill 1.1 pad 1.93)
  other vias: 60.96,34.29
N$5  (via drill 1.1 pad 1.93)
  other vias: 63.5,34.29
N$6  (via drill 1.1 pad 1.93)
  other vias: 53.34,31.75
N$7  (via drill 1.1 pad 1.93)
  other vias: 53.34,29.21
N$8  (via drill 1.1 pad 1.93)
  other vias: 53.34,26.67
N$9  (via drill 1.1 pad 1.93)
  other vias: 53.34,24.13
N$10  (via drill 1.1 pad 1.93)
  other vias: 53.34,21.59
N$11  (via drill 1.1 pad 1.93)
  other vias: 53.34,19.05
N$12  (via drill 1.1 pad 1.93)
  other vias: 53.34,16.51
N$13  (via drill 1.1 pad 1.93)
  other vias: 53.34,13.97
N$14  (via drill 1.1 pad 1.93)
  other vias: 55.88,13.97
N$15  (via drill 1.1 pad 1.93)
  other vias: 58.42,13.97
N$16  (via drill 0.5)
  Top 0.254: R3.1 SJ1.2 v39.88,38.1 | U1.7 v41.15,40.64
  Bottom 0.254: v41.15,40.64 39.88,39.37 v39.88,38.1
N$17  (via drill 1.1 pad 1.93)
  other vias: 60.96,13.97
N$18  (via drill 1.1 pad 1.93)
  other vias: 63.5,13.97
N$19  (via drill 1.1 pad 1.93)
  other vias: 63.5,16.51
N$20  (via drill 1.1 pad 1.93)
  other vias: 63.5,19.05
N$21  (via drill 1.1 pad 1.93)
  other vias: 63.5,21.59
N$22  (via drill 1.1 pad 1.93)
  other vias: 63.5,24.13
N$23  (via drill 1.1 pad 1.93)
  other vias: 63.5,31.75
N$24
  Top 0.254: R10.1 LED1.C
N$25
  Top 0.305: R11.7 26.18,8.24 JP1.4
N$26
  Top 0.305: R11.8 27.08,9.88 JP1.1
N$27
  Top 0.305: R11.6 25.38,7.73 JP1.7
N$28
  Top 0.305: R11.5 24.48,9.37 JP1.10
N$29
  Top 0.305: R13.8 14.13,10.13 JP2.1
N$30
  Top 0.305: R13.7 13.23,8.49 JP2.4
N$31
  Top 0.305: R13.6 12.43,7.47 JP2.7
N$32
  Top 0.305: R13.5 11.53,9.49 9.65,7.62 9.65,7.24 JP2.10
N$33
  Top 0.305: R14.5 36.93,9.11 JP6.10
N$34
  Top 0.305: R14.6 37.83,7.47 JP6.7
N$35
  Top 0.305: R14.7 38.63,8.49 JP6.4
N$36
  Top 0.305: R14.8 39.53,10.13 JP6.1
N$37
  Top 0.254: 47.47,9.37 47.47,7.11 JP5.10
  Top 0.305: R12.5 47.47,9.37
N$38
  Top 0.305: R12.6 48.37,8.91 JP5.7
N$39  (via drill 1.1 pad 1.93)
  other vias: 63.5,29.21
N$40
  Top 0.305: R12.7 49.17,9.51 49.91,8.76 51.05,8.76 JP5.4
N$41  (via drill 1.1 pad 1.93)
  other vias: 63.5,26.67
N$42  (via drill 1.1 pad 1.93)
  other vias: 60.96,31.75
N$43  (via drill 1.1 pad 1.93)
  other vias: 58.42,31.75
N$44  (via drill 1.1 pad 1.93)
  other vias: 55.88,31.75
N$45  (via drill 1.1 pad 1.93)
  other vias: 55.88,29.21
N$46  (via drill 1.1 pad 1.93)
  other vias: 58.42,29.21
N$47  (via drill 1.1 pad 1.93)
  other vias: 60.96,29.21
N$48  (via drill 1.1 pad 1.93)
  other vias: 60.96,26.67
N$49  (via drill 1.1 pad 1.93)
  other vias: 58.42,26.67
N$50  (via drill 1.1 pad 1.93)
  other vias: 55.88,26.67
N$51  (via drill 1.1 pad 1.93)
  other vias: 55.88,24.13
N$52  (via drill 1.1 pad 1.93)
  other vias: 58.42,24.13
N$53  (via drill 1.1 pad 1.93)
  other vias: 60.96,24.13
N$54  (via drill 1.1 pad 1.93)
  other vias: 60.96,21.59
N$55  (via drill 1.1 pad 1.93)
  other vias: 58.42,21.59
N$56  (via drill 1.1 pad 1.93)
  other vias: 55.88,21.59
N$57  (via drill 1.1 pad 1.93)
  other vias: 55.88,19.05
N$58  (via drill 1.1 pad 1.93)
  other vias: 58.42,19.05
N$59  (via drill 1.1 pad 1.93)
  other vias: 60.96,19.05
N$60  (via drill 1.1 pad 1.93)
  other vias: 60.96,16.51
N$61  (via drill 1.1 pad 1.93)
  other vias: 58.42,16.51
N$62  (via drill 1.1 pad 1.93)
  other vias: 55.88,16.51
N$63
  Top 0.305: R12.8 50.07,9.75 50.29,9.53 52.83,9.53 JP5.1
N$64  (via drill 1.1 pad 1.93)
  other vias: 53.34,11.43
N$65  (via drill 1.1 pad 1.93)
  other vias: 55.88,11.43
N$66  (via drill 1.1 pad 1.93)
  other vias: 58.42,11.43
N$67  (via drill 1.1 pad 1.93)
  other vias: 60.96,11.43
N$68  (via drill 1.1 pad 1.93)
  other vias: 63.5,11.43
OE
  Top 0.254: U2.23 38.69,21.93 R7.1
PWM0
  Top 0.305: U2.6 16.34,21.93 11.43,17.02 11.43,12.63 R13.4
PWM1
  Top 0.305: U2.7 16.96,21.28 12.45,16.76 12.45,12.55 R13.3
PWM2
  Top 0.305: U2.8 17.58,20.63 13.21,16.26 13.21,12.55 R13.2
PWM3
  Top 0.305: U2.9 18.46,19.98 14.22,15.75 14.22,12.63 R13.1
PWM4
  Top 0.305: U2.10 26.44,19.33 24.38,17.27 24.38,12.63 R11.4
PWM5
  Top 0.305: U2.11 27.32,18.68 25.4,16.76 25.4,12.55 R11.3
PWM6
  Top 0.305: U2.12 27.68,18.03 26.16,16.51 26.16,12.55 R11.2
PWM7
  Top 0.305: U2.13 28.05,17.38 27.18,16.51 27.18,12.63 R11.1
PWM8
  Top 0.305: U2.15 36.93,15.23 R14.4
PWM9
  Top 0.305: U2.16 36.47,17.38 37.83,16.02 R14.3
PWM10
  Top 0.305: U2.17 37.34,18.03 38.61,16.76 38.61,12.68 R14.2
PWM11
  Top 0.305: U2.18 37.96,18.68 39.62,17.02 39.62,12.76 R14.1
PWM12
  Top 0.254: U2.19 42.19,19.33 44.96,22.1 45.47,22.1 47.5,20.07 47.47,20.04 R12.4
PWM13
  Top 0.254: U2.20 42.08,19.98 44.7,22.61 45.85,22.61 48.39,20.07 48.39,15.62 48.37,15.6 R12.3
PWM14
  Top 0.254: U2.21 41.97,20.63 44.45,23.11 46.23,23.11 49.17,20.17 R12.2
PWM15
  Top 0.254: U2.22 41.85,21.28 44.2,23.62 46.86,23.62 50.07,20.42 R12.1
PWRIN  (via drill 0.6)
  Top 1.27: X1.PWR 12.64,36.04 18.29,36.04 | 18.29,36.04 Q1.3 | v18.03,35.56 18.29,35.81 18.29,36.04
  Bottom 1.27: 5VIN.1 18.03,30.59 v18.03,35.56
RXD
  Top 0.305: CONN1.4 10.92,48.26 11.43,48.26 12.95,49.78 13.97,49.78 14.73,50.55 14.73,51.82 15.37,52.45 17.14,52.45 18.46,53.77 RPI1.10
SCL  (via drill 0.5)
  Top 0.254: U2.26 34.79,23.88 32.26,26.42 19.05,26.42 18.54,26.92 18.54,29.21 17.27,30.48 9.14,30.48 6.86,32.77 v6.86,41.66
  Top 0.305: CONN1.2 6.6,49.02 11.24,49.02 RPI1.5
  Bottom 0.254: v6.86,41.66 4.83,43.69 CONN1.2
SDA
  Top 0.254: U2.27 34.91,24.53 32.51,26.92 19.56,26.92 19.3,27.18 19.3,29.21 17.27,31.24 9.14,31.24 7.87,32.51 7.87,42.16 6.6,43.43 4.57,43.43 2.29,45.72 CONN1.1
  Top 0.305: CONN1.1 2.29,47.75 3.3,48.77 4.83,48.77 5.84,49.78 9.91,49.78 10.91,50.79 RPI1.3
SPI_CE0
  Top 0.305: CONN1.16 37.59,50.04 37.59,52.2 36.31,53.48 RPI1.24
SPI_CE1
  Bottom 0.305: RPI1.26 38.85,53.61 40.13,52.32 40.13,50.04 CONN1.17
SPI_MISO
  Top 0.305: CONN1.14 33.77,48.78 RPI1.21
SPI_MOSI
  Top 0.305: CONN1.13 31.23,48.78 RPI1.19
SPI_SCLK
  Top 0.305: CONN1.15 36.31,48.78 RPI1.23
TXD
  Bottom 0.305: CONN1.3 9.65,49.53 11.18,49.53 12.19,50.55 12.19,52.32 12.32,52.45 14.61,52.45 15.92,53.77 RPI1.8

### Text on the board
tPlace: SDA | SCL | TXD | RXD | #4 | #17 | #18 | #27 | #22 | #23 | #24 | #25 | MOSI | MISO | CLK | CE0 | CE1 | #5 | #6 | #12 | #13 | #16 | #19 | #20 | #21 | 5-6VDC | 5.0V | 3.3V | GND | I2C Address | C2 | PCA9685 | 1+ | A5 | A4 | A3 | A2 | A1 | A0 | GND | Open=0/Closed=1 | +5 | 16 x 12-bit PWM | Servo/PWM Pi HAT! | POWER | adafruit! | 0 | 1 | 2 | 3 | 4 | 5 | 6 | 7 | 8 | 9 | 10 | 11 | 12 | 13 | 14 | 15 | S | V+ | G
tValues: 10K | 10K | 220 ohm | 220 ohm
tPlaceBlue: GND
tPlaceRed: +5V | +3V